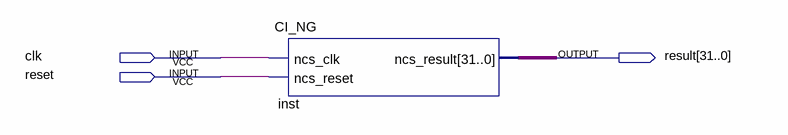
[diagram p0: schematic sheet]
// Quartus schematic NG_Controller_Klem.bdf as structural Verilog: 1 symbols, 3 pins
module NG_Controller_Klem (
  input  clk,
  input  reset,
  output [31:0] result
);

  CI_NG inst (.ncs_clk(clk), .ncs_reset(reset), .ncs_result(result));
endmodule
